# EAGLE design Puzzle Rotary v0.9 (EAGLE 6.2)
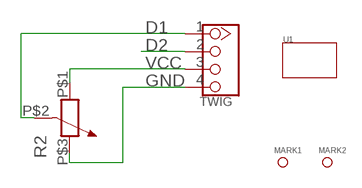
[diagram p0: schematic, sheet 1]

## Parts
J1  TWIG  TWIG-2.0-LEADED-2.0  [4P-LEADED-2.0]
MARK1  PAD-MARK  [ROUND-MARK-0.635]
MARK2  PAD-MARK  [ROUND-MARK-0.635]
R2  R-POTENTIOMETER-ALPS-POT  [3P-SQUA-13.6X12.4]
U1  TWIG-1U  [1U-DIM-W/-DRILL]

## Nets
D1: J1.1 R2.P$2
D2: J1.2
GND: J1.4 R2.P$3
VCC: J1.3 R2.P$1

## Library data of the parts
J1 = Connector:TWIG-2.0-LEADED
MARK1 MARK2 = Discrete:PAD-MARK
R2 = Seeedstudio-Discrete.rpt:R-POTENTIOMETER*: Potentiometer
U1 = Module:TWIG

## Board
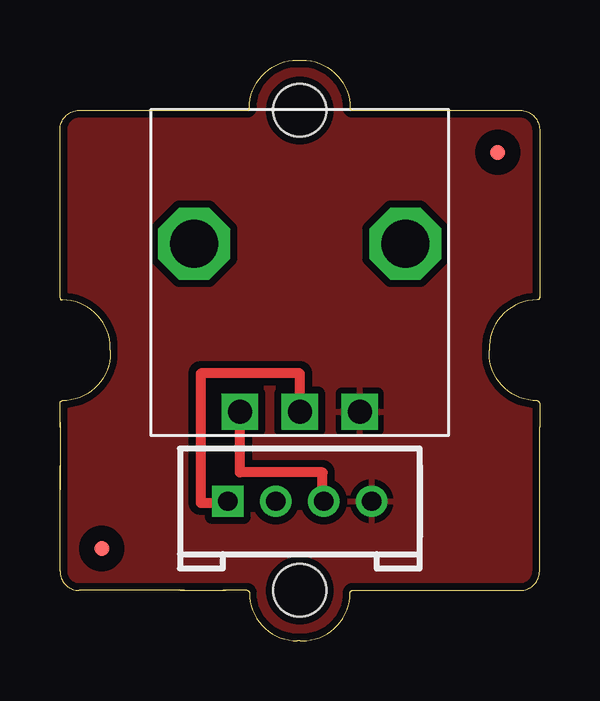
[diagram p1: board, top side]
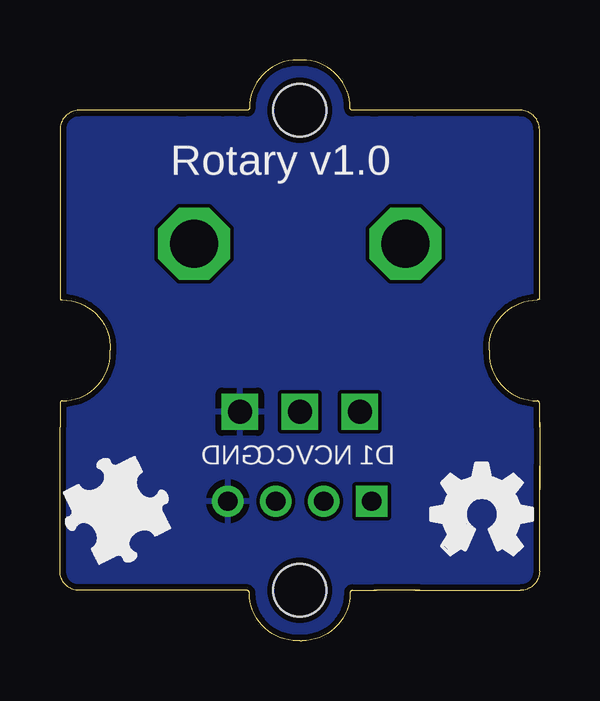
[diagram p2: board, bottom side, seen from below]

Size 20 x 24.2 mm. Coordinates in mm from the lower left corner, seen from the top.
Copper layers (1*16): Top 0.035mm / dielectric 1.5mm / Bottom 0.035mm
Design rules: minimum track width 6mil, minimum drill 12mil, track to track 6mil, track to pad 6mil, pad to pad 6mil, via to via 6mil, smd to smd 6mil, copper to edge 10mil, drill to drill 10mil, minimum pad ring 10mil, minimum via ring 8mil, stop-mask expansion 2mil, vias tented up to drill 100mil, thermal gap 10mil

### Footprints (pad centres in the part's own frame; a part is rotated, then mirrored left to right if it is on the bottom)
4P-LEADED-2.0 = drill 0.8 pad 1.27 square: 1 -3,0 | drill 0.8 pad 1.27: 2 -1,0; 3 1,0; 4 3,0
ROUND-MARK-0.635 = smd 0.635 x 0.635: P$1 0,0
3P-SQUA-13.6X12.4 = drill 1 square: P$1 7,-2.5; P$2 7,0; P$3 7,2.5 | drill 2 octagon: P$4 0,-4.4; P$5 0,4.4
1U-DIM-W/-DRILL = hole 2.2: 0,-10; 0,10

### Placement (x,y rotation side)
J1  10,5.81 0 top
LOGO2  LOGO-OSHW-FILLX0150-NT  [OSHW_FILLX150_NOTEXT]  4.54,3.59 0 bottom
MARK1  1.74,3.84 0 top
MARK2  18.25,20.35 0 top
R2  10,16.54 270 top
U1  10,12.1 0 top
U$1  [BRICK-LOGO-MIL-0.5]  20.16,2.89 0 bottom

### Tracks (layer width: path | path; a pad name or v marks a point on that pad's centre or on a via)
D1
  Top 0.406: R2.P$2 10,11.15 5.87,11.15 5.87,5.75 7,5.75 J1.1
GND
  pour Top (isolate 0.305): -0.16,-0.35 20.41,-0.35 20.41,25.05 -0.16,25.05
  pour Bottom: -0.16,-0.6 20.67,-0.6 20.67,25.31 -0.16,25.31
VCC
  Top 0.406: J1.3 10.95,5.81 10.95,7.02 7.5,7.02 R2.P$1

### Text on the board
bPlace: Rotary v1.0 | D1 | NC | VCC | GND